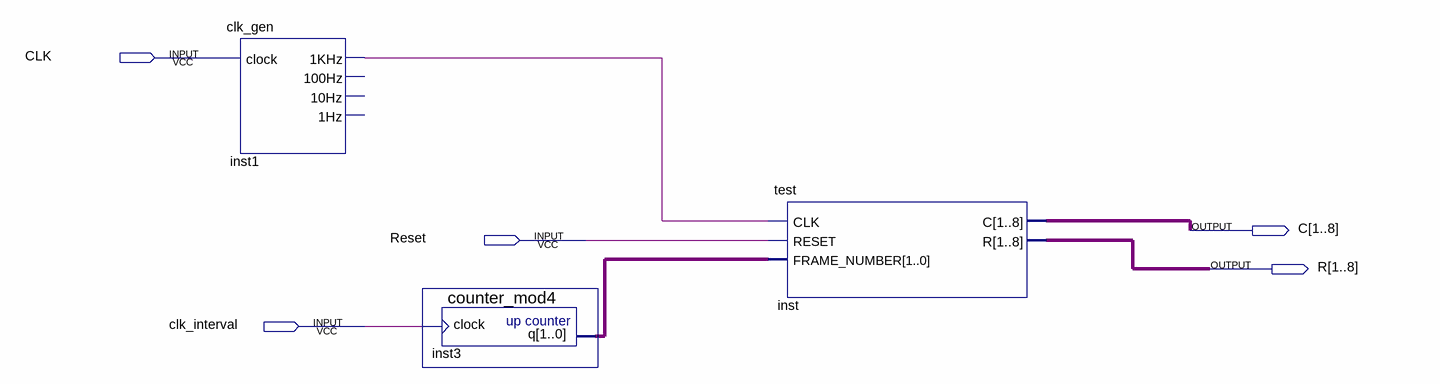
[diagram p0: schematic sheet]
// Quartus schematic test2.bdf as structural Verilog: 3 symbols, 5 pins
module test2 (
  input  CLK,
  input  Reset,
  input  clk_interval,
  output [1:8] C,
  output [1:8] R
);

  wire inst1_1khz;
  wire [1:0] inst3_q;

  clk_gen inst1 (.clock(CLK), .\1KHz (inst1_1khz));  // open: 100Hz, 10Hz, 1Hz
  counter_mod4 inst3 (.clock(clk_interval), .q(inst3_q));
  test inst (.CLK(inst1_1khz), .RESET(Reset), .FRAME_NUMBER(inst3_q), .C(C), .R(R));
endmodule
